# EAGLE design veloKinoLEd (EAGLE 7.0.0)
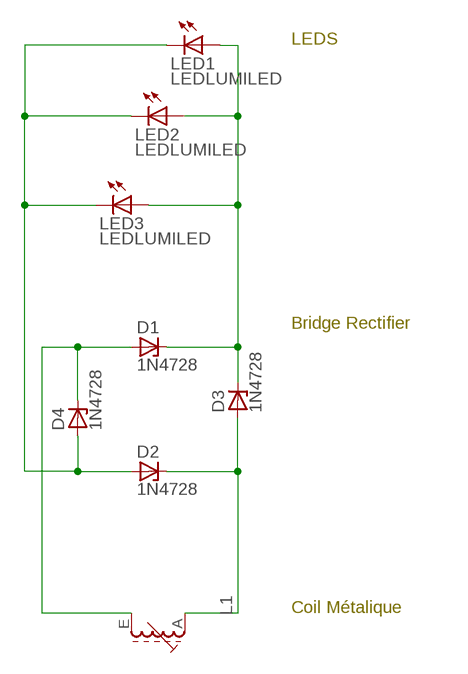
[diagram p0: schematic, sheet 1]

## Parts
D1  1N4728  [DO41Z10]
D2  1N4728  [DO41Z10]
D3  1N4728  [DO41Z10]
D4  1N4728  [DO41Z10]
L1  71E  [71E]
LED1  LEDLUMILED  [LUMILED]
LED2  LEDLUMILED  [LUMILED]
LED3  LEDLUMILED  [LUMILED]

## Nets
N$1: D1.C D3.C LED1.2+(A) LED2.2+(A) LED3.2+(A)
N$2: D2.C D3.A L1.A
N$3: D2.A D4.A LED1.4-(C) LED2.4-(C) LED3.4-(C)
N$6: D1.A D4.C L1.E
Unconnected: L1.S1 L1.S2

## Notes on the sheet
- LEDS
- Bridge Rectifier
- Coil Métalique

## Library data of the parts
D1-D4 = diode:1N4728: Z DIODE 3.3 V, 1W, 5 percent
L1 = inductor-neosid:71E: FILTER adjustable filter coil, Type E; OC_FARNELL: unknown; OC_NEWARK: unknown
LED1-LED3 = led-lumiled:LED: LED - LUMILED® LXK2-PW12-R00, LXK2-PW12-S00, LXK2-PW14-U00, LXK2-PW14-V00 LXK2-PM12-R00, LXK2-PM12-S00, LXK2-PM14-U00 LXK2-PE12-Q00, LXK2-PE12-R00, LXK2-PE12-S00, LXK2-PE14-T00, LXK2-PE14-U00 LXK2-PB12-K00, LXK2-PB12-L00, LXK2-PB12-M00, LXK2-PB14-N00, LXK2-PB14-P00, LXK2-PB14-Q00 LXK2-PR12-L00, LXK2-PR12-M00, LXK2-PR14-Q00, LXK2-PR14-R00 LXK2-PD12-Q00, LXK2-PD12-R00, LXK2-PD12-S00 LXK2-PH12-R00, LXK2-PH12-S00 LXK2-PL12-P00, LXK2-PL12-Q00, LXK2-PL12-R00 Source: www.luxeon.com; OC_FARNELL: unknown; OC_NEWARK: unknown

## Board
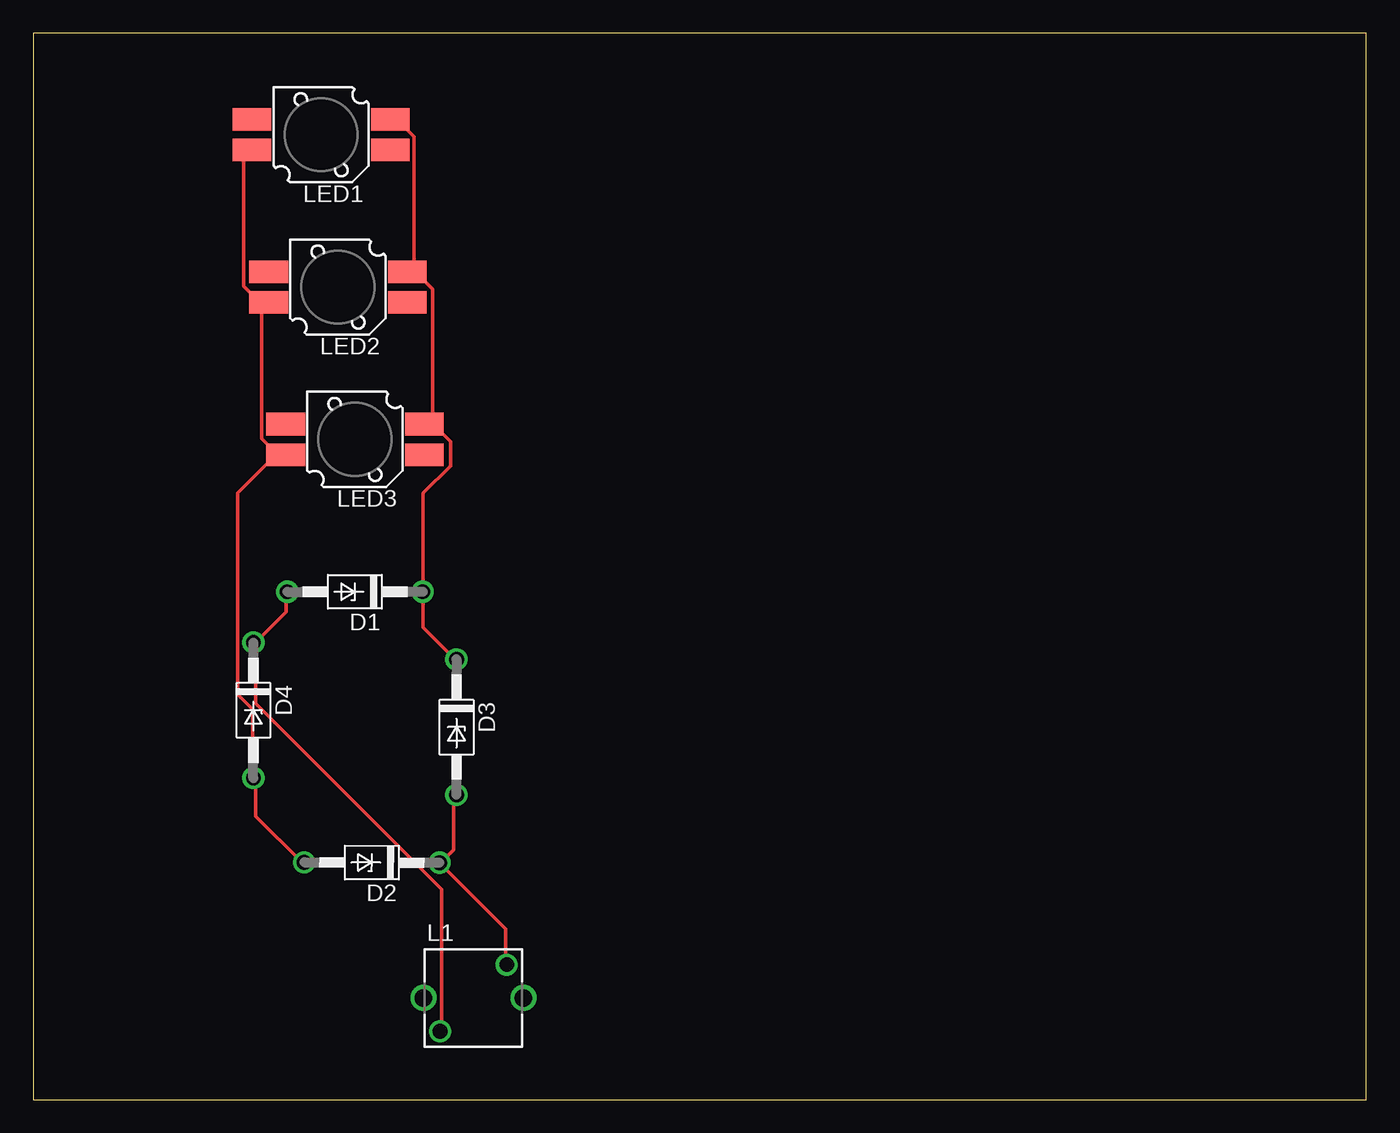
[diagram p1: board, top side]

Size 100 x 80 mm. Coordinates in mm from the lower left corner, seen from the top.
Outline: 0,0 100,0 100,80 0,80 0,0
Copper layers (1*16): Top 0.035mm / dielectric 1.5mm / Bottom 0.035mm
Design rules "default": minimum track width 10mil, minimum drill 24mil, track to track 8mil, track to pad 8mil, pad to pad 8mil, via to via 8mil, smd to smd 8mil, copper to edge 40mil, drill to drill 8mil, minimum pad ring 10mil, minimum via ring 8mil, stop-mask expansion 4mil, vias tented up to drill 0mil, thermal gap 10mil

### Footprints (pad centres in the part's own frame; a part is rotated, then mirrored left to right if it is on the bottom)
DO41Z10 = drill 1.118: A 5.08,0; C -5.08,0
71E = drill 1.1: A 2.5,2.5; E -2.5,-2.5 | drill 1.3: S1 -3.75,0; S2 3.75,0
LUMILED = smd 2.9 x 1.7: 1NC -5.2,1.15; 2+ -5.2,-1.15; 3NC 5.2,-1.15; 4- 5.2,1.15

### Placement (x,y rotation side)
D1  24.13,38.1 180 top
D2  25.4,17.78 179.8 top
D3  31.75,27.94 270 top
D4  16.51,29.21 270 top
L1  33.02,7.62 0 top
LED1  21.59,72.39 180 top
LED2  22.86,60.96 180 top
LED3  24.13,49.53 180 top

### Tracks (layer width: path | path; a pad name or v marks a point on that pad's centre or on a via)
N$1
  Top 0.254: D3.C 31.55,33.15 29.26,35.43 29.26,37.95 D1.C 29.26,38.18 29.26,45.49 31.32,47.55 31.32,49.38 29.72,50.98 | 28.57,61.95 28.8,61.95 29.95,60.81 29.95,51.21 29.72,50.98 | 28.57,61.95 28.12,61.95 LED2.2+ 28.57,61.95 | 29.72,50.98 29.49,50.75 LED3.2+ 29.72,50.98 | 28.57,61.95 28.57,72.24 27.43,73.38 26.98,73.38 LED1.2+
N$2
  Top 0.254: L1.A 35.43,10.29 35.43,12.8 30.63,17.6 D2.C 30.63,17.83 31.55,18.75 31.55,22.86 D3.A
N$3
  Top 0.254: D2.A 20.12,17.83 16.69,21.26 16.69,24 D4.A 16.46,24.23 16.46,29.26 15.32,30.4 15.32,45.49 18.29,48.46 | 17.14,59.89 16.92,59.89 15.77,61.04 15.77,70.64 16.23,71.09 LED1.4- | 17.14,59.89 17.6,59.89 LED2.4- 17.14,59.89 | 18.29,48.46 18.75,48.46 LED3.4- 18.29,48.46 | 18.29,48.46 17.14,49.61 17.14,59.89
N$6
  Top 0.254: 16.69,34.29 16.69,29.72 30.63,15.77 30.63,5.26 L1.E | 16.69,34.29 18.97,36.58 18.97,37.95 D1.A | 16.69,34.29 D4.C